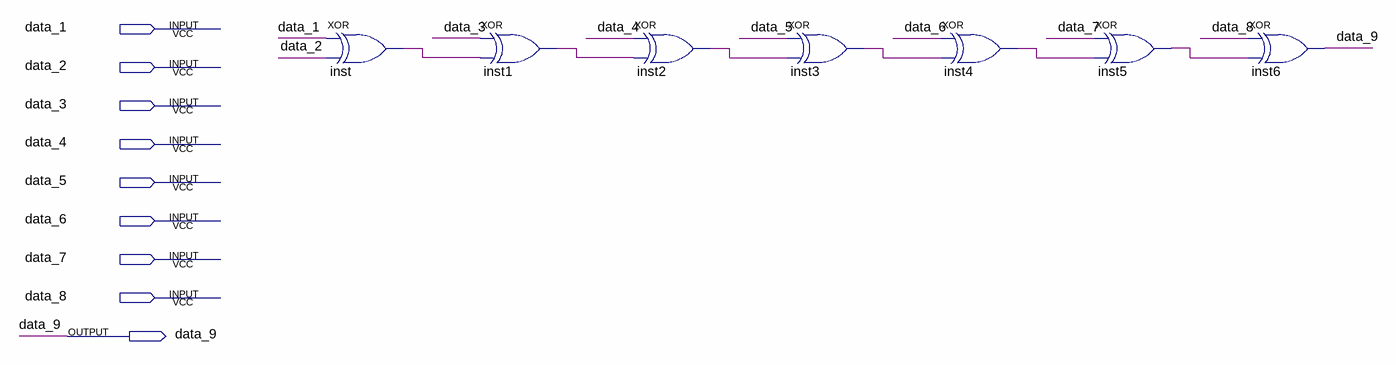
[diagram p0: schematic sheet]
// Quartus schematic parity_bit_make.bdf as structural Verilog: 7 symbols, 9 pins
module parity_bit_make (
  input  data_1,
  input  data_2,
  input  data_3,
  input  data_4,
  input  data_5,
  input  data_6,
  input  data_7,
  input  data_8,
  output data_9
);

  wire inst1_out, inst2_out, inst3_out, inst4_out, inst5_out, inst_out;

  xor inst (inst_out, data_1, data_2);
  xor inst1 (inst1_out, data_3, inst_out);
  xor inst2 (inst2_out, data_4, inst1_out);
  xor inst3 (inst3_out, data_5, inst2_out);
  xor inst4 (inst4_out, data_6, inst3_out);
  xor inst5 (inst5_out, data_7, inst4_out);
  xor inst6 (data_9, data_8, inst5_out);
endmodule
